# EAGLE design brick_serial_ble_BLE113 (EAGLE 7.4.0)
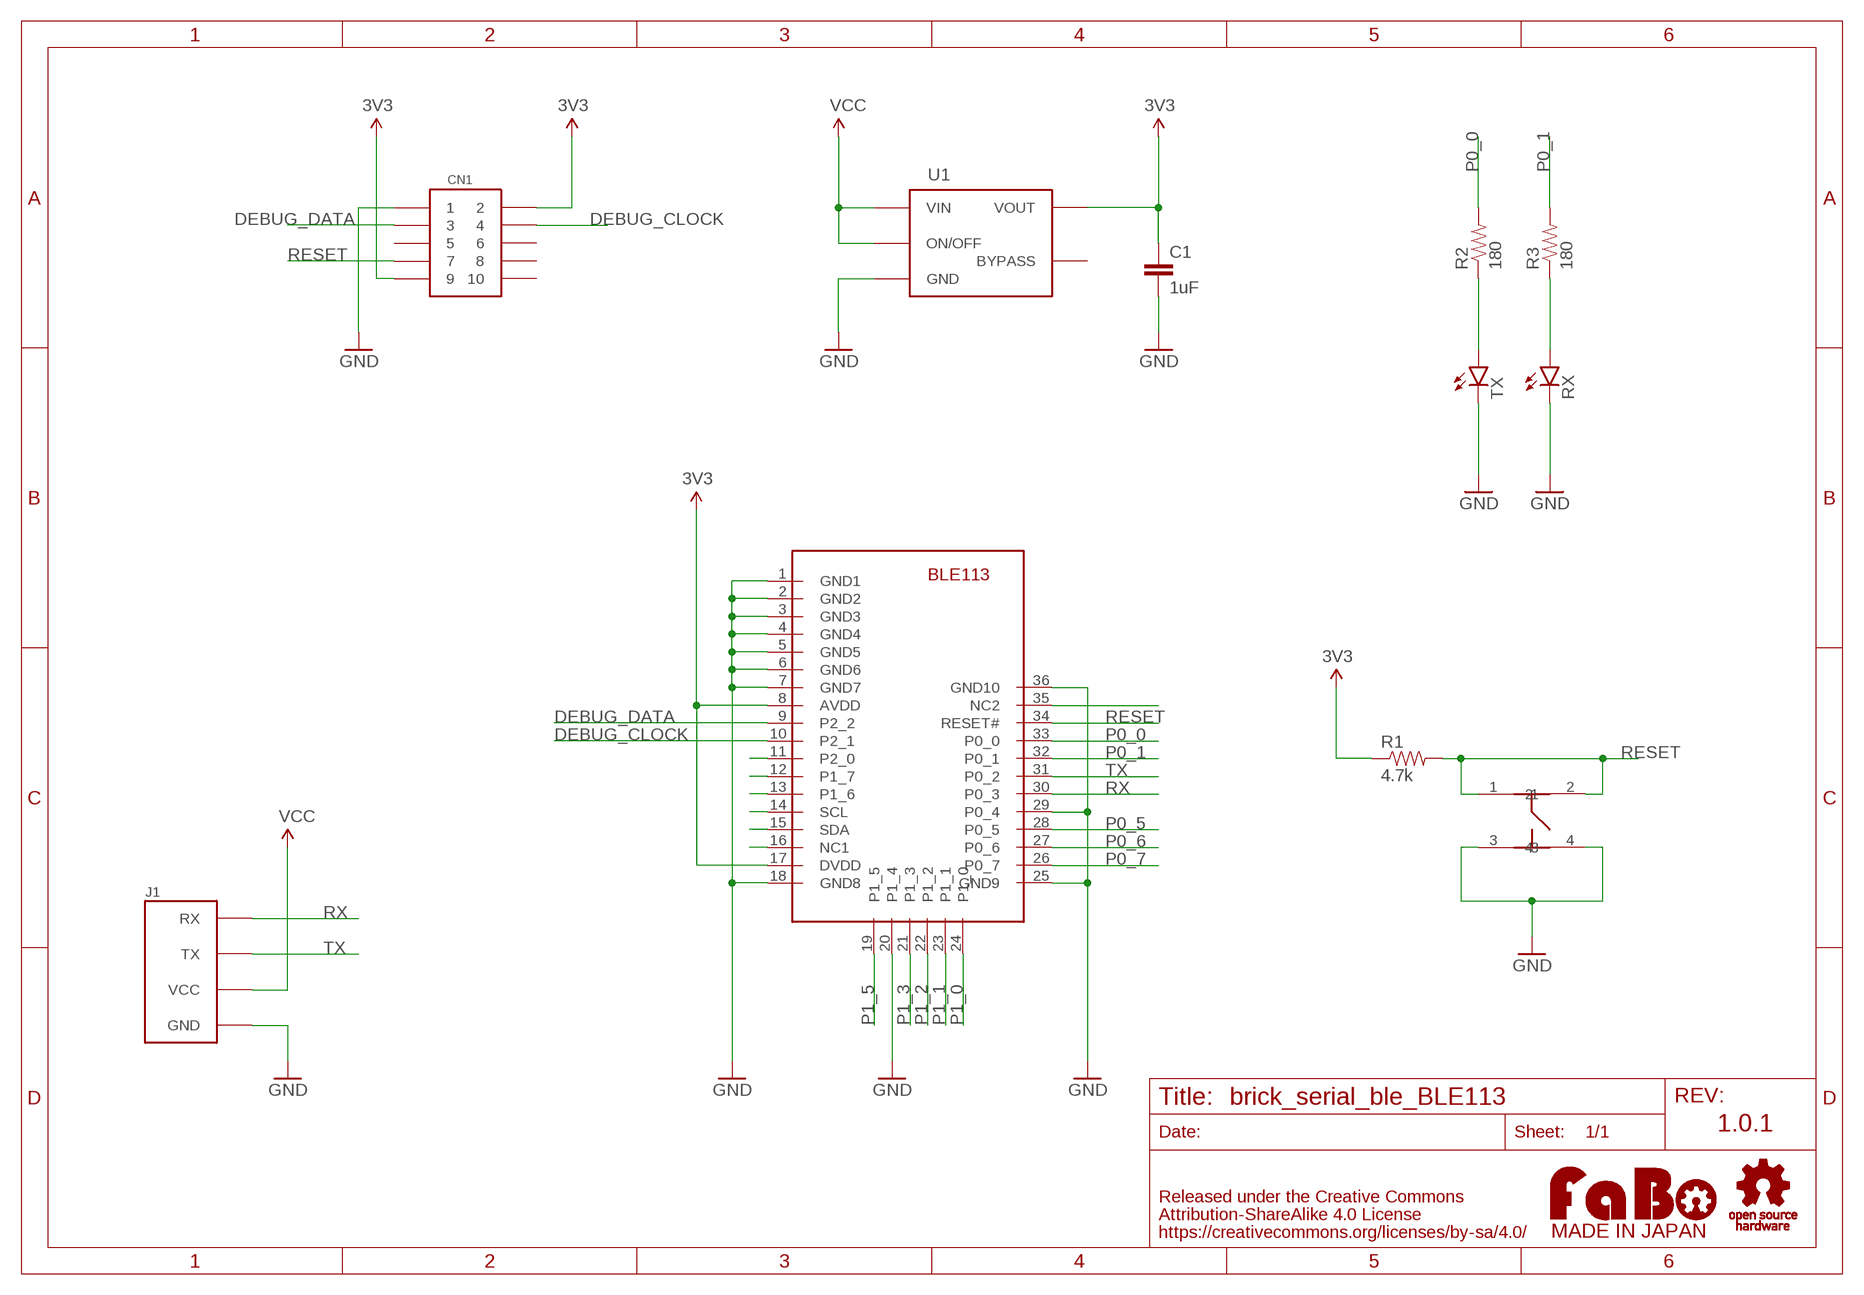
[diagram p0: schematic, sheet 1]

## Parts
C1  1uF  CAP-EIA0603  [EIA0603]
CN1  PIN-HEADER-SMT(1.27MM)2X5  [PIN-HEADER-SMT(1.27MM)2X5]
J1  FABO_BRICK_SERIAL  [FABO_BRICK_SERIAL]
R1  4.7k  RES-EIA0603  [EIA0603]
R2  180  RES-EIA0603  [EIA0603]
R3  180  RES-EIA0603  [EIA0603]
RX  LED-EIA0603  [EIA0603-LED]
TX  LED-EIA0603  [EIA0603-LED]
U1  LP2985-33DBVR  [SOT_23_5]
U$2  LOGO_OSHW-T_M_BOTTOM  [LOGO_OSHW_T_M_BOTTOM]
U$3  LOGO_FABO-M_BOTTOM  [LOGO_FABO_M_BOTTOM]
U$6  BLUEGIGA-BLE113  [BLUEGIGA-BLE113]
U$7  SWICTH-4P(KMR2)  [SWITCH-4P(KMR2)]

## Nets
3V3: C1.1 CN1.2 CN1.9 R1.1 U1.5(VOUT) U$6.8(AVDD) U$6.17(DVDD)
DEBUG_CLOCK: CN1.4 U$6.10(P2_1)
DEBUG_DATA: CN1.3 U$6.9(P2_2)
GND: C1.2 CN1.1 J1.GND RX.C TX.C U1.2(GND) U$6.1(GND1) U$6.2(GND2) U$6.3(GND3) U$6.4(GND4) U$6.5(GND5) U$6.6(GND6) U$6.7(GND7) U$6.18(GND8) U$6.20(P1_4) U$6.25(GND9) U$6.29(P0_4) U$6.36(GND10) U$7.3 U$7.4
N$1: R2.1 TX.A
N$2: R3.1 RX.A
NC1: U$6.16(NC1)
NC2: U$6.35(NC2)
P0_0: R2.2 U$6.33(P0_0)
P0_1: R3.2 U$6.32(P0_1)
P0_5: U$6.28(P0_5)
P0_6: U$6.27(P0_6)
P0_7: U$6.26(P0_7)
P1_0: U$6.24(P1_0)
P1_1: U$6.23(P1_1)
P1_2: U$6.22(P1_2)
P1_3: U$6.21(P1_3)
P1_5: U$6.19(P1_5)
P2_0: U$6.11(P2_0)
RESET: CN1.7 R1.2 U$6.34(RESET#) U$7.1 U$7.2
RX: J1.RX U$6.30(P0_3)
RX2_LV: U$6.12(P1_7)
SCL: U$6.14(SCL)
SDA: U$6.15(SDA)
TX: J1.TX U$6.31(P0_2)
TX2_LV: U$6.13(P1_6)
VCC: J1.VCC U1.1(VIN) U1.3(ON/OFF)
Unconnected: CN1.5 CN1.6 CN1.8 CN1.10 U1.4(BYPASS)

## Notes on the sheet
- 1.0.1

## Library data of the parts
C1 = FaBo-etc:CAP: Capacitor Standard 0603 ceramic capacitor
CN1 = FaBo-etc:PIN-HEADER-SMT(1.27MM)2X5: PIN-HEADER-SMT (1.27MM) 2x5
J1 = FaBo-Template:FABO_BRICK_SERIAL: FaBo Brick Serial
R1-R3 = FaBo-etc:RES
RX TX = FaBo-etc:LED: LED
U1 = FaBo-Supply:LP2985: LP2985 IC REG LDO 3.3V 0.15 A
U$2 = FaBo-etc:LOGO_OSHW
U$3 = FaBo-etc:LOGO_FABO
U$6 = gclueBT:BLUEGIGA-BLE113: Bluegiga BLE113 Bluetooth Bluetooth 4.0 low energy radio Radio Transmit power: +0 dBm Receiver sensitivity: -93 dBm Typical line-of-sight range: 30 - 100 meters Current Consumption TX peak current: 18.2 mA, 14.3 ma (with DC/DC) RX peak current: 17.9 mA Power mode 1: 270 uA Power mode 2: 1 uA Power mode 3: 0.4 uA Certifications Japan: MIC Japan( 007-AB0103)
U$7 = gclue:SWICTH-4P(KMR2)

## Net classes
0 default: width 0.203 mm, clearance 0.254 mm

## Board
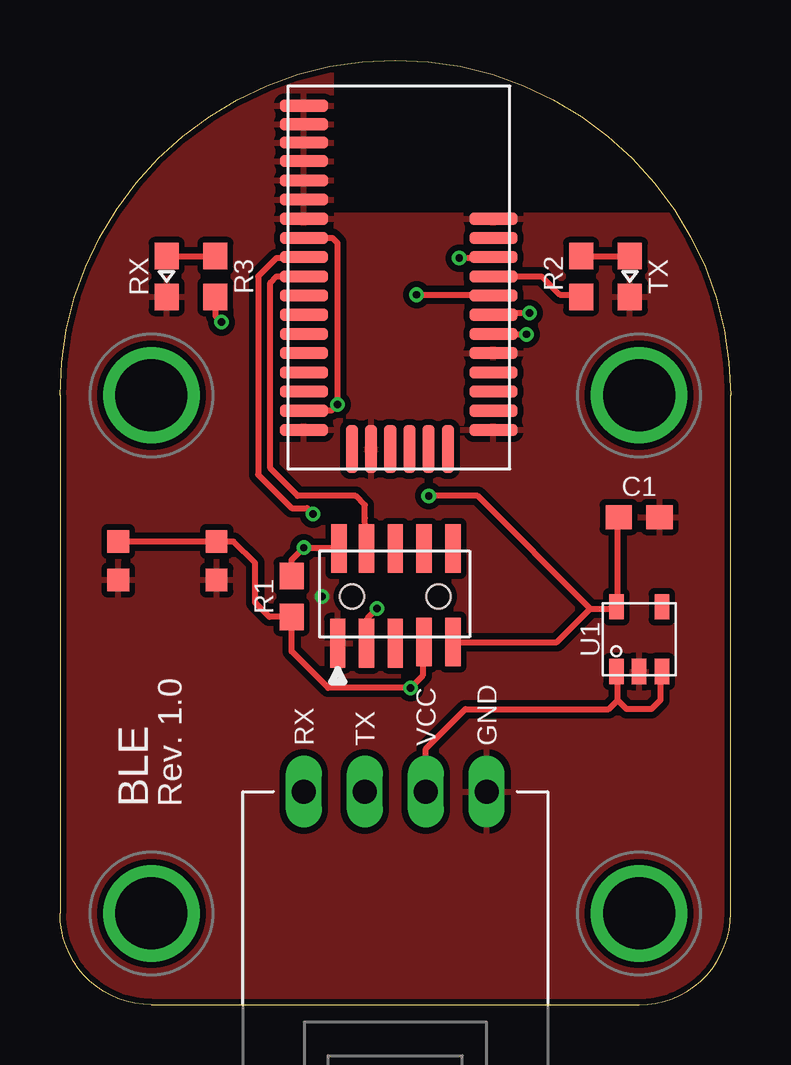
[diagram p1: board, top side]
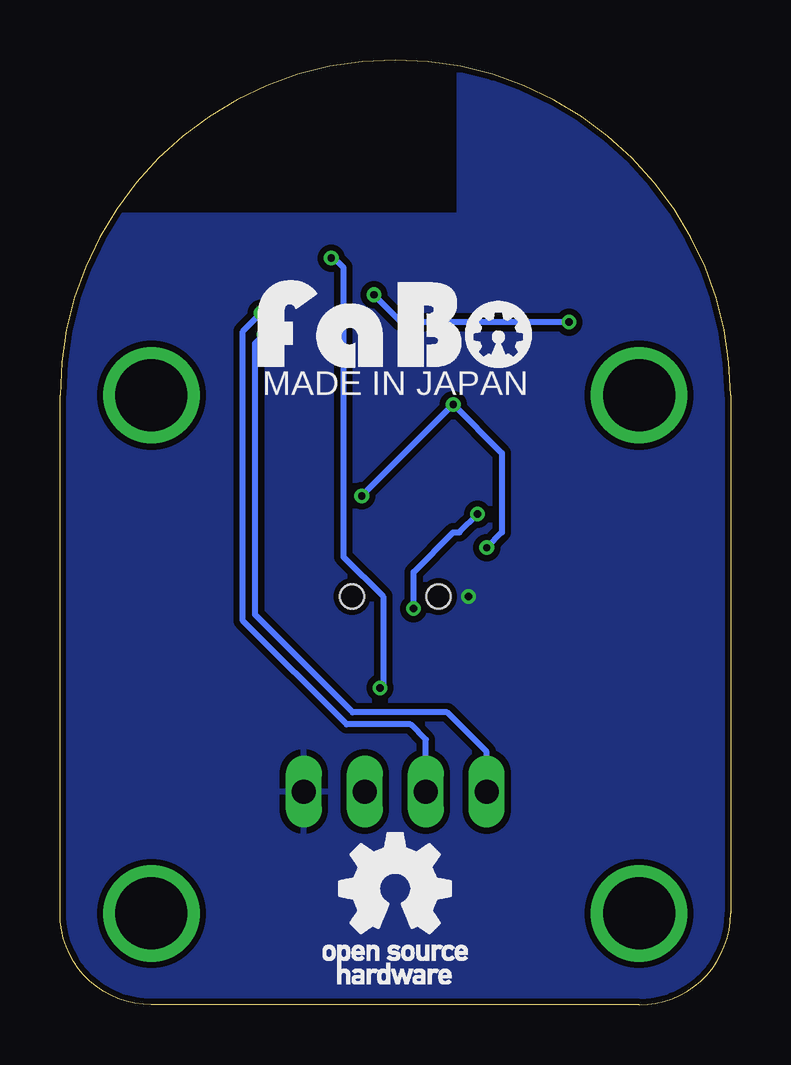
[diagram p2: board, bottom side, seen from below]

Size 27.94 x 39.37 mm. Coordinates in mm from the lower left corner, seen from the top.
Copper layers (1*16): Top 0.035mm / dielectric 1.5mm / Bottom 0.035mm
Design rules "Elecrow_2-layer_eagle_rule": minimum track width 6mil, minimum drill 12mil, track to track 6mil, track to pad 6mil, pad to pad 6mil, via to via 6mil, smd to smd 0mil, copper to edge 10mil, drill to drill 10mil, minimum pad ring 10mil, minimum via ring 6mil, stop-mask expansion 2mil, vias tented up to drill 100mil, thermal gap 10mil
tRestrict: area 11.4,33 to 29.2,40.6
bRestrict: area 11.4,33 to 29.2,40.6

### Footprints (pad centres in the part's own frame; a part is rotated, then mirrored left to right if it is on the bottom)
EIA0603 = smd 1.1 x 1: 1 -0.85,0; 2 0.85,0
PIN-HEADER-SMT(1.27MM)2X5 = smd 0.635 x 2.032: 1 -2.4,-1.95; 2 -2.35,2; 3 -1.2,-1.95; 4 -1.2,2; 5 0,-1.95; 6 0,2; 7 1.2,-1.9; 8 1.2,2; 9 2.4,-1.9; 10 2.4,2 | hole 1: 1.8,0; -1.8,0
FABO_BRICK_SERIAL = drill 1 long: GND 3.81,-10.16; RX -3.81,-10.16; TX -1.27,-10.16; VCC 1.27,-10.16 | drill 3 pad 3.81: P$5 -10.16,6.35; P$6 10.16,6.35; P$7 -10.16,-15.24; P$8 10.16,-15.24
EIA0603-LED = smd 1.1 x 1: A -0.85,0; C 0.85,0
SOT_23_5 = smd 0.6 x 1.05: 1 -0.95,-1.35; 2 0,-1.35; 3 0.95,-1.35; 4 0.95,1.35; 5 -0.95,1.35
BLUEGIGA-BLE113 = smd 2 x 0.5: 1 -3.81,6.35; 2 -3.81,5.58; 3 -3.81,4.81; 4 -3.81,4.04; 5 -3.81,3.24; 6 -3.81,2.44; 7 -3.81,1.64; 8 -3.81,0.84; 9 -3.81,0.04; 10 -3.81,-0.76; 11 -3.81,-1.56; 12 -3.81,-2.36; 13 -3.81,-3.16; 14 -3.81,-3.96; 15 -3.81,-4.76; 16 -3.81,-5.56; 17 -3.81,-6.36; 18 -3.81,-7.16; 25 4.09,-7.16; 26 4.09,-6.36; 27 4.09,-5.56; 28 4.09,-4.76; 29 4.09,-3.96; 30 4.09,-3.16; 31 4.09,-2.36; 32 4.09,-1.56; 33 4.09,-0.76; 34 4.09,0.04; 35 4.09,0.84; 36 4.09,1.64 | smd 0.5 x 2: 19 -1.81,-7.96; 20 -1.01,-7.96; 21 -0.21,-7.96; 22 0.59,-7.96; 23 1.39,-7.96; 24 2.19,-7.96
SWITCH-4P(KMR2) = smd 0.9 x 0.95: 1 -1,0; 2 3.1,0; 3 -1,-1.6; 4 3.1,-1.6

### Placement (x,y rotation side)
C1  24.13,20.32 0 top
CN1  13.97,17.02 0 top
J1  13.97,19.05 0 top
R1  9.65,17.02 270 top
R2  21.72,30.35 270 top
R3  6.48,30.35 270 top
RX  4.45,30.35 270 top
TX  23.75,30.35 270 top
U1  24.13,15.24 0 top
U$2  13.97,4.83 0 top
U$3  13.97,26.54 0 top
U$6  13.97,31.11 0 top
U$7  3.43,19.3 0 top

### Tracks (layer width: path | path; a pad name or v marks a point on that pad's centre or on a via)
3V3  (via drill 0.3)
  Top 0.254: C1.1 23.24,20.28 23.24,17.02 23.18,16.96 U1.5 23.1,16.51 22.1,16.51 | R1.1 9.65,18.54 v10.16,19.05 11.59,19.05 CN1.2 | U$6.8 11.35,31.95 11.56,31.75 v11.56,25.02 11.3,24.77 10.17,24.77 U$6.17 | CN1.9 20.71,15.12 22.1,16.51 | 22.1,16.51 17.4,21.21 v15.37,21.21
  Bottom 0.254: v15.37,21.21 v11.56,25.02 9.53,22.99 9.53,19.68 v10.16,19.05
DEBUG_CLOCK
  Top 0.254: CN1.4 12.7,20.29 12.7,20.83 12.32,21.21 9.91,21.21 8.76,22.35 8.76,30.1 9.02,30.35 U$6.10
DEBUG_DATA  (via drill 0.3)
  Top 0.254: U$6.9 9.44,31.16 9.4,31.11 9.02,31.11 8.26,30.35 8.26,22.1 9.65,20.7 10.29,20.7 v10.54,20.45 | CN1.3 12.77,15.82 12.83,15.88 12.83,16.13 v13.21,16.51
  Bottom 0.254: v13.21,16.51 13.21,18.03 11.56,19.68 11.3,19.68 v10.54,20.45
GND  (via drill 0.3)
  other vias: 10.92,17.02
  pour Bottom: -1.27,-1.27 29.21,-1.27 29.21,40.64 -1.27,40.64
  pour Top: -1.27,-1.27 29.21,-1.27 29.21,40.64 -1.27,40.64
N$1
  Top 0.254: R2.1 TX.A
N$2
  Top 0.254: RX.A R3.1
P0_0
  Top 0.254: U$6.33 18.92,30.36 18.92,30.35 20.07,30.35 20.83,29.59 21.63,29.59 R2.2
P0_1  (via drill 0.3)
  Top 0.254: R3.2 6.48,28.7 v6.73,28.45 | v14.86,29.59 18.02,29.59 U$6.32
  Bottom 0.254: v6.73,28.45 13.72,28.45 v14.86,29.59
RESET  (via drill 0.3)
  Top 0.254: CN1.7 15.17,15.04 15.11,14.99 15.11,13.72 v14.61,13.21 11.18,13.21 9.65,14.73 R1.2 8.72,16.17 8.13,16.76 8.13,18.41 7.24,19.3 U$7.2 U$7.1 | U$6.34 17.31,31.16 17.27,31.11 v16.64,31.11
  Bottom 0.254: v16.64,31.11 16.51,31.11 16.13,30.73 16.13,18.67 14.48,17.02 14.48,13.34 v14.61,13.21
RX  (via drill 0.3)
  Top 0.254: U$6.30 18.15,27.95 18.16,27.94 v19.43,27.94
  Bottom 0.254: J1.RX 10.16,10.54 11.81,12.19 15.75,12.19 19.81,16.26 19.81,27.56 v19.43,27.94
TX  (via drill 0.3)
  Top 0.254: U$6.31 18.09,28.75 18.16,28.83 v19.56,28.83
  Bottom 0.254: J1.TX 12.7,11.05 13.34,11.68 16,11.68 20.32,16 20.32,28.07 v19.56,28.83
VCC
  Top 0.254: J1.VCC 15.24,10.67 16.89,12.32 22.86,12.32 23.24,12.7 | U1.3 25.08,13.52 25.02,13.46 25.02,12.7 24.64,12.32 23.62,12.32 23.24,12.7 | 23.24,12.7 23.24,13.83 U1.1

### Text on the board
tPlace: BLE | Rev. 1.0
bPlace: MADE IN JAPAN